# Altium schematic sheet AIRZAI_LED_SENSE_FLEX_REVA.SchDoc
size B
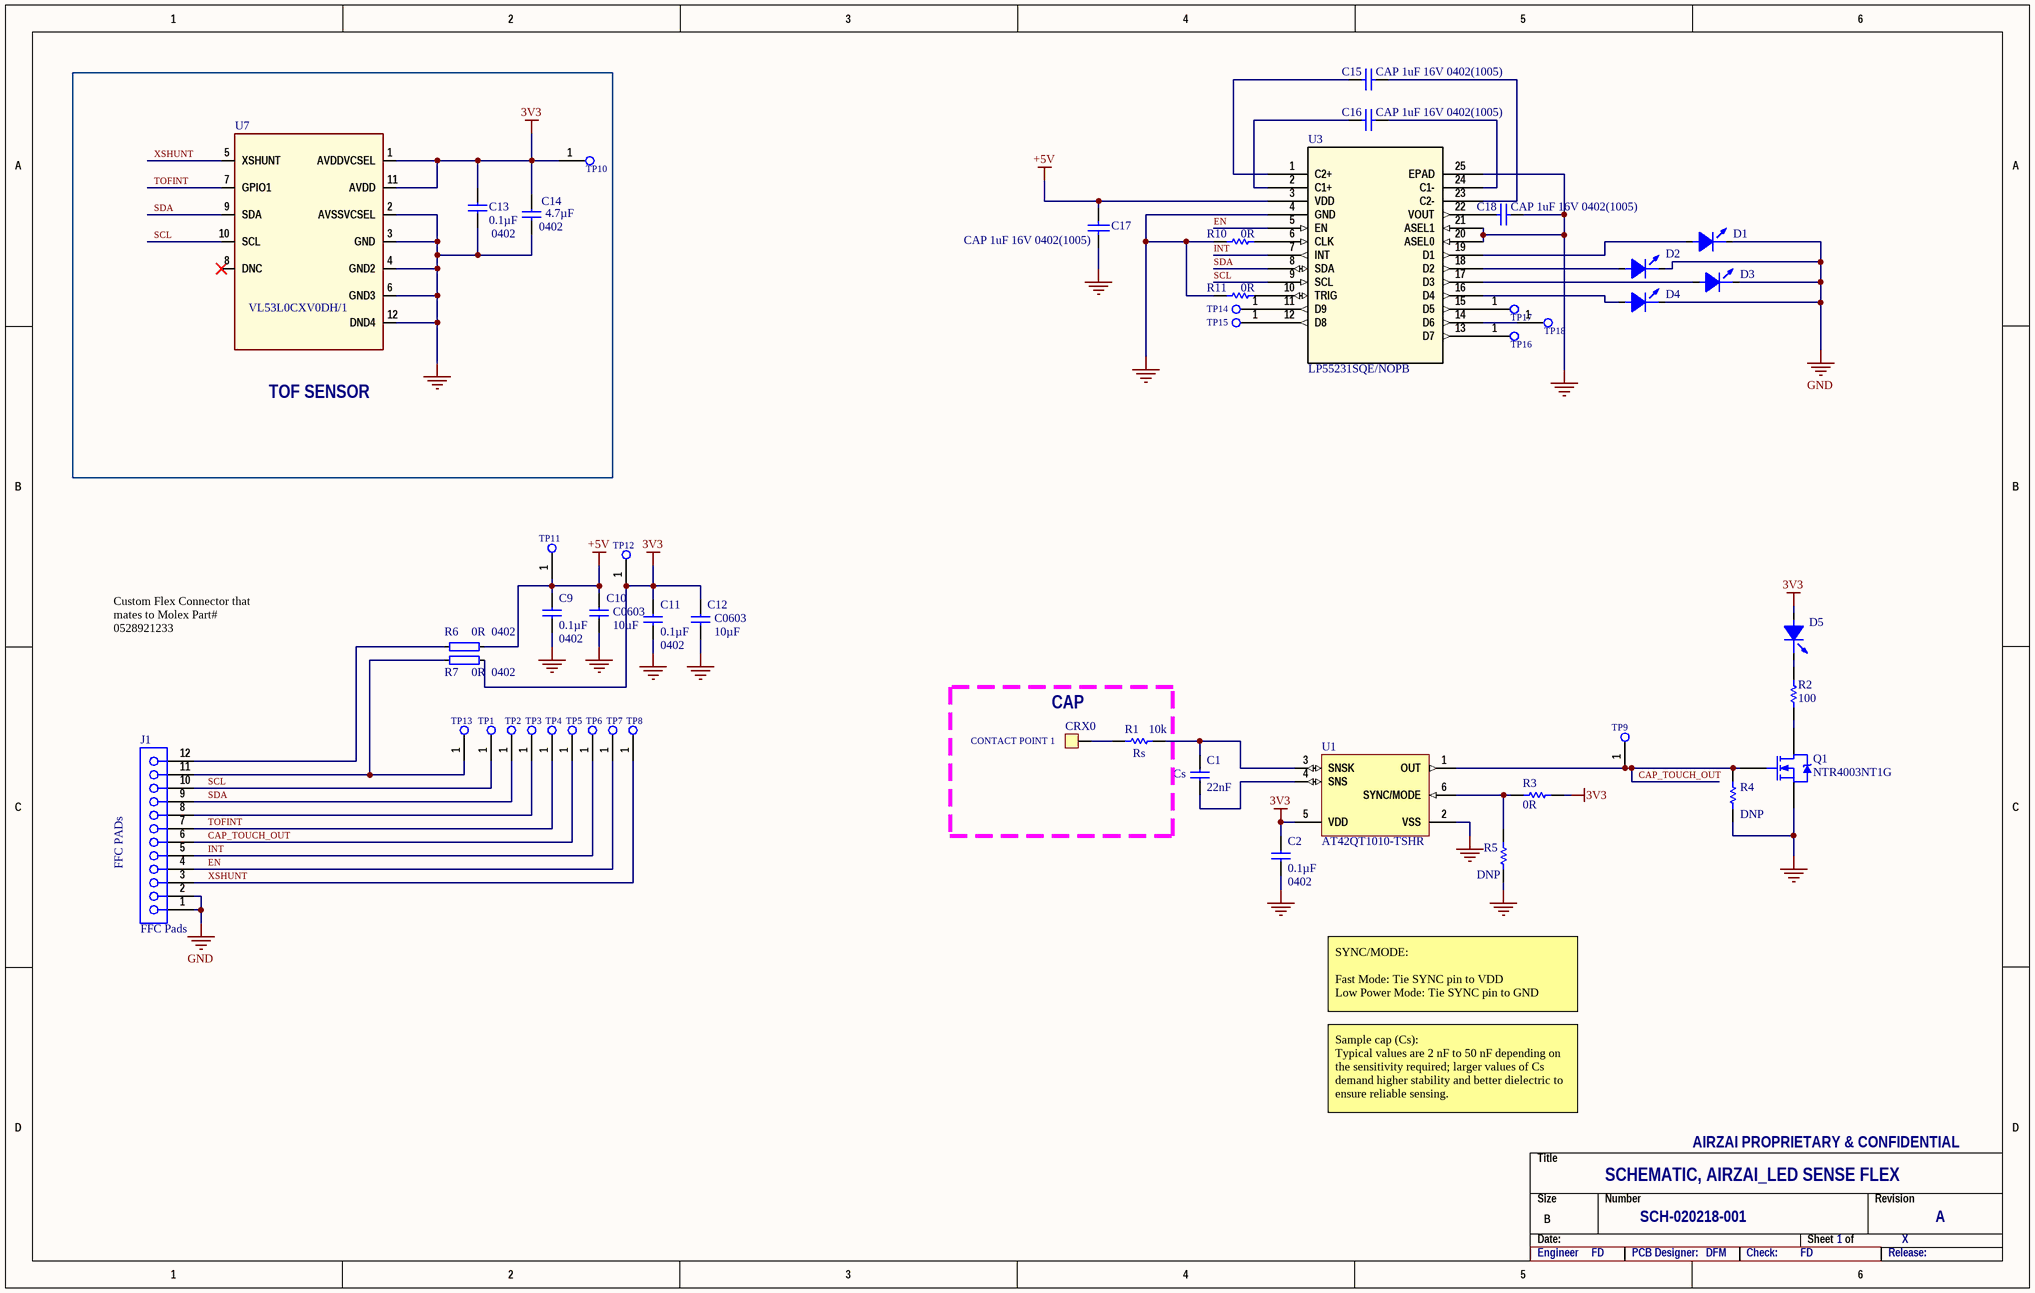
[diagram p0: AIRZAI_LED_SENSE_FLEX_REVA.SchDoc]

## Parts
C1  22nF  [0402CAP]
C2  0.1µF  Footprint: 0402  [0402CAP]
C9  0.1µF  Footprint: 0402  [0402CAP]
C10  10µF  Footprint: C0603  [0603]
C11  0.1µF  Footprint: 0402  [0402CAP]
C12  10µF  Footprint: C0603  [0603]
C13  0.1µF  Footprint: 0402  [0402CAP]
C14  4.7µF  Footprint: 0402  [0603]
C15  CAP 1uF 16V 0402(1005)  [CAPC0402(1005)60_M]
C16  CAP 1uF 16V 0402(1005)  [CAPC0402(1005)60_M]
C17  CAP 1uF 16V 0402(1005)  [CAPC0402(1005)60_M]
C18  CAP 1uF 16V 0402(1005)  [CAPC0402(1005)60_M]
CRX0  CONTACT POINT 1  [CONTACT_POINT_1CM _SQ]
D1  WHITE  [LED1206_LTW-C230DS]  (value not drawn)
D2  WHITE  [LED1206_LTW-C230DS]  (value not drawn)
D3  WHITE  [LED1206_LTW-C230DS]  (value not drawn)
D4  WHITE  [LED1206_LTW-C230DS]  (value not drawn)
D5  WHITE  [LED1206_LTW-C230DS]  (value not drawn)
J1  FFC Pads  [FFC_Pads]
Q1  NTR4003NT1G  [TO-220AB]
R1  value 10k  [0402]  (hidden comment: 10k 0402(1005))
R2  value 100  [0402]  (hidden comment: 100R 0402(1005))
R3  value 0R  [0402]  (hidden comment: Jumper 0402(1005))
R4  value DNP  [0402]  (hidden comment: DNP 0402(1005))
R5  value DNP  [0402]  (hidden comment: DNP 0402(1005))
R6  0R  [0402]
R7  0R  [0402]
R10  value 0R  [0402]  (hidden comment: Jumper 0402(1005))
R11  value 0R  [0402]  (hidden comment: Jumper 0402(1005))
TP1  Test Point  [TP_0.9MM]  (value not drawn)
TP2  Test Point  [TP_0.9MM]  (value not drawn)
TP3  Test Point  [TP_0.9MM]  (value not drawn)
TP4  Test Point  [TP_0.9MM]  (value not drawn)
TP5  Test Point  [TP_0.9MM]  (value not drawn)
TP6  Test Point  [TP_0.9MM]  (value not drawn)
TP7  Test Point  [TP_0.9MM]  (value not drawn)
TP8  Test Point  [TP_0.9MM]  (value not drawn)
TP9  Test Point  [TP_0.9MM]  (value not drawn)
TP10  Test Point  [TP_0.9MM]  (value not drawn)
TP11  Test Point  [TP_0.9MM]  (value not drawn)
TP12  Test Point  [TP_0.9MM]  (value not drawn)
TP13  Test Point  [TP_0.9MM]  (value not drawn)
TP14  Test Point  [TP_0.9MM]  (value not drawn)
TP15  Test Point  [TP_0.9MM]  (value not drawn)
TP16  Test Point  [TP_0.9MM]  (value not drawn)
TP17  Test Point  [TP_0.9MM]  (value not drawn)
TP18  Test Point  [TP_0.9MM]  (value not drawn)
U1  AT42QT1010-TSHR  [SOT-23-6-AT42QT1010-TSHR]
U3  LP55231SQE/NOPB  [WQFN-24-LP55231SQE/NOPB]
U7  VL53L0CXV0DH/1  [VL53L0X]

## Blocks framed on the sheet
TOF SENSOR: C13 C14 TP10 U7
CAP: CRX0 R1

## Nets
3V3: C2.1 C11.1 C12.1 C13.1 C14.2 D5.2(ANODE) R3.2 R7.1 TP10.1 TP12.1 U1.5(VDD) U7.1(AVDDVCSEL) U7.11(AVDD)
+5V: C9.1 C10.1 C17.2 R6.1 TP11.1 U3.3(VDD)
GND: C2.2 C9.2 C10.2 C11.2 C12.2 C13.2 C14.1 C17.1 C18.2 D1.1(CATHODE) D2.1(CATHODE) D3.1(CATHODE) D4.1(CATHODE) J1.1 J1.2 Q1.3(S) R4.2 R5.2 R10.1 R11.1 U1.2(VSS) U3.4(GND) U3.20(ASEL0) U3.21(ASEL1) U3.25(EPAD) U7.2(AVSSVCSEL) U7.3(GND) U7.4(GND2) U7.6(GND3) U7.12(DND4)
CAP_TOUCH_OUT: J1.6 Q1.1(G) R4.1 TP5.1 TP9.1 U1.1(OUT)
EN: J1.4 TP7.1 U3.5(EN)
INT: J1.5 TP6.1 U3.7(INT)
SCL: J1.10 TP1.1 U3.9(SCL) U7.10(SCL)
SDA: J1.9 TP2.1 U3.8(SDA) U7.9(SDA)
TOFINT: J1.7 TP4.1 U7.7(GPIO1)
XSHUNT: J1.3 TP8.1 U7.5(XSHUNT)
NetC1_1: C1.1 R1.1 U1.3(SNSK)
NetC1_2: C1.2 U1.4(SNS)
NetC15_1: C15.1 U3.1(C2+)
NetC15_2: C15.2 U3.23(C2-)
NetC16_1: C16.1 U3.2(C1+)
NetC16_2: C16.2 U3.24(C1-)
NetC18_1: C18.1 U3.22(VOUT)
NetCRX0_1: CRX0.1 R1.2
NetD1_2: D1.2(ANODE) U3.19(D1)
NetD2_2: D2.2(ANODE) U3.18(D2)
NetD3_2: D3.2(ANODE) U3.17(D3)
NetD4_2: D4.2(ANODE) U3.16(D4)
NetD5_1: D5.1(CATHODE) R2.2
NetJ1_8: J1.8 TP3.1
NetJ1_11: J1.11 R7.2 TP13.1
NetJ1_12: J1.12 R6.2
NetQ1_2: Q1.2(D) R2.1
NetR3_1: R3.1 R5.1 U1.6(SYNC/MODE)
NetR10_2: R10.2 U3.6(CLK)
NetR11_2: R11.2 U3.10(TRIG)
NetTP14_1: TP14.1 U3.11(D9)
NetTP15_1: TP15.1 U3.12(D8)
NetTP16_1: TP16.1 U3.13(D7)
NetTP17_1: TP17.1 U3.15(D5)
NetTP18_1: TP18.1 U3.14(D6)

Not connected (* = marked no-connect by the designer): U7 8(DNC)*

## Notes on the sheet
- Custom Flex Connector that mates to Molex Part# 0528921233
- (near R1) Rs
- (near C1) Cs
- (near J1) FFC PADs
- SYNC/MODE:
  Fast Mode: Tie SYNC pin to VDD
  Low Power Mode: Tie SYNC pin to GND
- Sample cap (Cs):
  Typical values are 2 nF to 50 nF depending on the sensitivity required; larger values of Cs demand higher stability and better dielectric to ensure reliable sensing.
- SCHEMATIC, AIRZAI_LED SENSE FLEX
- AIRZAI PROPRIETARY & CONFIDENTIAL
- SCH-020218-001
- 1
- X
- A
- Engineer
- FD
- PCB Designer:
- DFM
- Check:
- Release:

## Library data of the parts
C1 = C0402-100n: Capacitor, X7R, ±10%; Manufacturer: TDK; Manufacturer Part Number: CGA2B2X7R1E223K050BA; Voltage Rating (DC): 25V; Value: 22nF; ComponentLink1URL: http://www.mouser.com/ds/2/281/c02e-2905.pdf?src-supplier=Mouser; ComponentLink1Description: http://www.mouser.com/ds/2/281/c02e-2905.pdf?src-supplier=Mouser; ComponentLink2URL: http://psearch.en.murata.com/capacitor/product/GRM155R71H333KE14%23.pdf?src-supplier=Avnet; ComponentLink2Description: http://psearch.en.murata.com/capacitor/product/GRM155R71H333KE14%23.pdf?src-supplier=Avnet; ComponentLink3URL: http://search.murata.co.jp/Ceramy/image/img/A01X/G101/ENG/GRM155R71H333KE14-01.pdf?src-supplier=Digi-Key; ComponentLink3Description: http://search.murata.co.jp/Ceramy/image/img/A01X/G101/ENG/GRM155R71H333KE14-01.pdf?src-supplier=Digi-Key; Supplier 1: Digi-Key; Supplier Part Number 1: 445-5609-1-ND; Stock 1: 499669; Pricing 1: 1 = 0.10000, 10 = 0.06500, 100 = 0.02910, 500 = 0.02080, 1000 = 0.01635, 2500 = 0.01486, 5000 = 0.01367 (USD); RoHS: Yes; Mount: Surface Mount; Case/Package: 0402; Weight: 2.3E-05oz; Case Code (Imperial): 0402; Case Code (Metric): 1005; Min Operating Temperature: -55°C; Max Operating Temperature: 125°C; Capacitance: 22nF; Tolerance: 10%; Packaging: Tape and Reel; Package Quantity: 1; Voltage Rating: 25V; Dielectric: X7R; Termination: SMD/SMT; Composition: Ceramic; Length: 1mm; Height: 0.5mm; Width: 0.5mm; Thickness: 0.022inch; Depth: 0.5mm; Ratings: AEC-Q200; REACH SVHC: No SVHC; ComponentLink4URL: https://datasheet.ciiva.com/24220/cga2b2x7r1e223k050ba-265693-24220032.pdf?src-supplier=Mouser; ComponentLink4Description: https://datasheet.ciiva.com/24220/cga2b2x7r1e223k050ba-265693-24220032.pdf?src-supplier=Mouser; ComponentLink5URL: https://datasheet.ciiva.com/7975/1807242-7975269.pdf?src-supplier=Element14; ComponentLink5Description: https://datasheet.ciiva.com/7975/1807242-7975269.pdf?src-supplier=Element14
C2 C9 C11 C13 = C0402-100n: Capacitor, X7R, ±10%; Manufacturer: TDK; Manufacturer Part Number: C1005X7R1C104K; Note: 16V ±10% X7R; Case-Metric: 1005; Rated Voltage: 16 V; Tolerance: Â±20%; Datasheet: *; Pin Count: 2; Value: 0.1µF; Supplier: *; Supplier part number: *; 2nd source Supplier: *; 2nd source part number: *; Case-EIA: 0402; Max Thickness: 0.6 mm; Supplier 1: Digi-Key; Supplier Part Number 1: 445-4952-2-ND; Technology: SMT
C10 C12 = C0402-100n: Capacitor, X7R, ±10%; Manufacturer: MURATA; Manufacturer Part Number: GRM188R60J106ME47D; Note: 6.3volts X5R 20%; Case-Metric: 1608; Rated Voltage: 6.3 V; Tolerance: Â±20%; Value: 10µF; Case-EIA: 0603; Max Thickness: 0.9 mm; Pin Count: 2; Supplier 1: Digi-Key; Supplier Part Number 1: 490-3896-6-ND; Technology: SMT
C14 = C0603-1µ0 X7R: Capacitor, X7R, ±10%; Manufacturer: TDK; Manufacturer Part Number: C1005X5R0J475M; Case-Metric: 1005; Note: 6.3volts X5R 20%; Rated Voltage: 6.3 V; Tolerance: Â±20%; Value: 4.7µF; Case-EIA: 0402; Max Thickness: 0.6 mm; Supplier 1: Digi-Key; Supplier Part Number 1: 445-7395-2-ND; Technology: SMT
C15-C18 = CAP: CAP 1uF 16V ±10% 0402 (1005 Metric) Thickness 0.6mm SMD; Manufacturer: Taiyo Yuden; Manufacturer Part Number: JMK105C6105KV-F; Case-EIA: 0402; Rated Voltage: 6.3 V; Tolerance: Â±10%; Case-Metric: 1005; Note: CAP CER 1UF 6.3V X6S 0402; Technology: SMT; Max Thickness: 0.6 mm; Value: 1uF; Pin Count: 2; Supplier 1: Digi-Key; Supplier Part Number 1: 587-3381-1-ND
CRX0 = WIRE_POINT
D1-D5 = LED_LTW-C230DS: Manufacturer: LITEON; Note: REVERSE MOUNT CHIP LED; Case-EIA: 1206; Case-Metric: 3216; Manufacturer Part Number: LTW-C230DS; Value: WHITE; Footprint: LED_LTW-C230DS; Supplier 1: Digi-Key; Supplier Part Number 1: 160-2221-1-ND; Max Thickness: 1.10mm
J1 = FFC_PADS: 0.5 mm Pitch FFC Pads; Note: DNP; ComponentLink2URL: http://www.molex.com/webdocs/datasheets/pdf/en-us/0528921233_FFC_FPC_CONNECTORS.pdf; ComponentLink1URL: http://www.molex.com/molex/index.jsp; ComponentLink3URL: http://www.molex.com/pdm_docs/sd/528921233_sd.pdf; ComponentLink2Description: Datasheet; ComponentLink3Description: Package Specification
Q1 = NMOS-2: MOSFET N-CH 30V 500MA SOT-23; Manufacturer: ON Semiconductor; Nominal Vgs: 1.4V; Rise Time: 47.9ns; Input Capacitance: 21pF; Number of Elements: 1; Max Power Dissipation: 690mW; Rds On Max: 1.5R; Drain to Source Resistance: 1R; Turn-Off Delay Time: 65.1ns; Turn-On Delay Time: 16.7ns; Element Configuration: Single; Gate to Source Voltage (Vgs): 20V; Value: NTR4003NT1G; ComponentLink1Description: Manufacturer Link; ComponentLink1URL: http://www.irf.com/; Supplier 1: Digi-Key; Supplier Part Number 1: NTR4003NT1GOSCT-ND; Manufacturer Part Number: NTR4003NT1G; Stock 1: 83954; Pricing 1: 1 = 0.30000, 10 = 0.27200, 100 = 0.15230, 500 = 0.08160, 1000 = 0.05548 (USD); RoHS: Yes; Case/Package: SOT-23-3; Number of Pins: 3; Contact Plating: Tin; Min Operating Temperature: -55°C; Max Operating Temperature: 150°C; Package Quantity: 1; Packaging: Tape and Reel; Continuous Drain Current (ID): 500mA; Drain to Source Breakdown Voltage: 30V; Fall Time: 47.9ns; Power Dissipation: 690mW; Threshold Voltage: 1.4V; On-State Resistance: 1R; Length: 3.04mm; Height: 1.01mm; Width: 1.4mm; Radiation Hardening: No; REACH SVHC: No SVHC; Lead Free: Lead Free; ComponentLink2URL: https://datasheet.ciiva.com/5751/86005-5751936.pdf?src-supplier=Farnell; ComponentLink2Description: https://datasheet.ciiva.com/5751/86005-5751936.pdf?src-supplier=Farnell; ComponentLink3URL: https://datasheet.ciiva.com/26144/ntr4003n-d-26144544.pdf?src-supplier=Avnet+Europe; ComponentLink3Description: https://datasheet.ciiva.com/26144/ntr4003n-d-26144544.pdf?src-supplier=Avnet+Europe; ComponentLink4URL: https://datasheet.ciiva.com/30479/0900766b8120606c-30479654.pdf?src-supplier=RSComponents; ComponentLink4Description: https://datasheet.ciiva.com/30479/0900766b8120606c-30479654.pdf?src-supplier=RSComponents; ComponentLink5URL: https://datasheet.ciiva.com/30479/0900766b8120606c-30479655.pdf?src-supplier=RSComponents; ComponentLink5Description: https://datasheet.ciiva.com/30479/0900766b8120606c-30479655.pdf?src-supplier=RSComponents; ComponentLink6URL: https://datasheet.ciiva.com/936/ntr4003n-d-936807.pdf?src-supplier=Digi-Key; ComponentLink6Description: https://datasheet.ciiva.com/936/ntr4003n-d-936807.pdf?src-supplier=Digi-Key; ComponentLink7URL: https://datasheet.ciiva.com/8114/ntr4003n-d-8114935.pdf?src-supplier=Avnet; ComponentLink7Description: https://datasheet.ciiva.com/8114/ntr4003n-d-8114935.pdf?src-supplier=Avnet; ComponentLink8URL: https://datasheet.ciiva.com/936/ntr4003n-d-936808.pdf?src-supplier=Digi-Key; ComponentLink8Description: https://datasheet.ciiva.com/936/ntr4003n-d-936808.pdf?src-supplier=Digi-Key; ComponentLink9URL: https://datasheet.ciiva.com/936/ntr4003n-d-936809.pdf?src-supplier=Digi-Key; ComponentLink9Description: https://datasheet.ciiva.com/936/ntr4003n-d-936809.pdf?src-supplier=Digi-Key; ComponentLink10URL: https://datasheet.ciiva.com/8059/86005-8059403.pdf?src-supplier=Element14; ComponentLink10Description: https://datasheet.ciiva.com/8059/86005-8059403.pdf?src-supplier=Element14; ComponentLink11URL: https://datasheet.ciiva.com/8059/86005-8059404.pdf?src-supplier=Element14; ComponentLink11Description: https://datasheet.ciiva.com/8059/86005-8059404.pdf?src-supplier=Element14; ComponentLink12URL: https://datasheet.ciiva.com/22656/86005-22656046.pdf?src-supplier=Farnell; ComponentLink12Description: https://datasheet.ciiva.com/22656/86005-22656046.pdf?src-supplier=Farnell
R1 = RES: 10k 0.063W 1% 0402 (1005 Metric)  SMD; Manufacturer: Yageo; Manufacturer Part Number: RC0402FR-0710KL; Tolerance: None; Case-Metric: 1005; Note: RES SMD 10K OHM 1% 1/16W 0402; Power: 0.063W; Case-EIA: 0402; Technology: SMT; Max Thickness: 0.6 mm; Pin Count: 2; Supplier 1: Digi-Key; Supplier Part Number 1: 311-10.0KLRCT-ND
R2 = RES: 100 0.063W 1% 0402 (1005 Metric)  SMD; Manufacturer: Yageo; Manufacturer Part Number: RC0402FR-07100RL; Tolerance: None; Case-Metric: 1005; Note: 0.1W JUMPER; Power: None; Case-EIA: 0402; Technology: SMT; Max Thickness: 0.6 mm; Pin Count: 2; Supplier 1: Digi-Key; Supplier Part Number 1: 311-100LRCT-ND
R3 R10 R11 = RES: Jumper 0402 (1005 Metric); Manufacturer: Panasonic; Manufacturer Part Number: ERJ-2GE0R00X; Tolerance: None; Case-Metric: 1005; Note: 0.1W JUMPER; Power: None; Case-EIA: 0402; Technology: SMT; Max Thickness: 0.6 mm; Pin Count: 2; Supplier 1: Digi-Key; Supplier Part Number 1: P0.0JCT-ND
R4 R5 = RES: DNP; Tolerance: None; Case-Metric: 1005; Power: 0.0625 W; Case-EIA: 0402; Technology: SMT; Manufacturer Part Number: DNP; Max Thickness: 0.6 mm; Note: DNP; Pin Count: 2; Supplier 1: Digi-Key; Supplier Part Number 1: DNP
R6 R7 = R0402-12k: Resistor, ±1%, 0.063W; Manufacturer: Panasonic; Manufacturer Part Number: ERJ-2GE0R00X; Note: 0.1W JUMPER; Case-Metric: 1005; Tolerance: None; Datasheet: *; Pin Count: 2; Value: 0R; 2nd source Supplier: *; 2nd source part number: *; Case-EIA: 0402; Max Thickness: 0.6 mm; Supplier 1: Digi-Key; Technology: SMT
  R6: Supplier Part Number 1: P0.0JTR-ND
  R7: Supplier Part Number 1: P0.0JCT-ND
U1 = AT42QT1010-TSHR: One-channel Touch Sensor IC with Reset Timer, -40° to +85° C, 6-pin SOT23; ComponentLink1Description: Manufacturer URL; ComponentLink2Description: Datasheet; DatasheetVersion: revH, May-2010; ComponentLink1URL: http://www.atmel.com/; Code_JEDEC: MO-178-AB; Code_IPC: SOT26A-6; PackageVersion: revA, Jun-2008; PackageDescription: 6-Lead, 2.90 x 1.60 mm Plastic Small Outline Package (SOT23); ComponentLink2URL: http://www.atmel.com/Images/doc9541.pdf; PackageReference: 6ST1; PartNumber: AT42QT1010-TSHR; Supplier Part Number 1: AT42QT1010-TSHRCT-ND
U3 = LP55231SQE/NOPB: Imported; Manufacturer: TI; Vendor: Texas Instruments; Built_By: EMA_UL_Team; Value: IC LED DRIVER RGLTR DIM 24WQFN; C: Copyright (C) 2016 Accelerated Designs. All rights reserved; Case-EIA: 24-WQFN; Tolerance: None; Manufacturer_Part_Number: LP55231SQE/NOPB; RefDes: RefDes; Type: DEV; Manufacturer Part Number: LP55231SQE/NOPB; Note: IC LED DRIVER RGLTR DIM 24WQFN; Supplier 1: Digi-Key; Supplier Part Number 1: 296-39059-1-ND; Technology: SMT
U7 = VL53L0X: Manufacturer: ST; Note: SENSOR LASER DISTANCE TOF 2M; Case-EIA: LGA12; Tolerance: None; Manufacturer Part Number: VL53L0CXV0DH/1; Value: VL53L0CXV0DH/1; Supplier 1: Digi-Key; Supplier Part Number 1: 497-16538-1-ND; Technology: SMT